# Altium schematic sheet UI.SchDoc
size A4
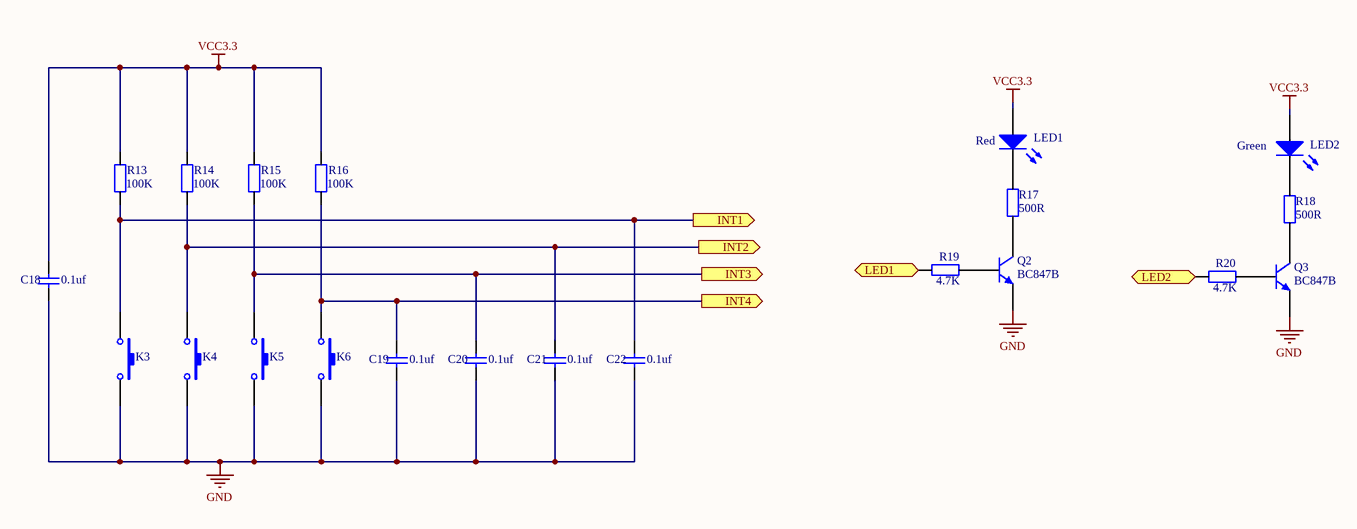
[diagram p0: UI.SchDoc]

## Parts
C18  value 0.1uf  [0603]  (hidden comment: Capacitor-0603)
C19  value 0.1uf  [0603]  (hidden comment: Capacitor-0603)
C20  value 0.1uf  [0603]  (hidden comment: Capacitor-0603)
C21  value 0.1uf  [0603]  (hidden comment: Capacitor-0603)
C22  value 0.1uf  [0603]  (hidden comment: Capacitor-0603)
K3  按键  [mini按键]  (value not drawn)
K4  按键  [mini按键]  (value not drawn)
K5  按键  [mini按键]  (value not drawn)
K6  按键  [mini按键]  (value not drawn)
LED1  Color: Red  [外插小灯]  (hidden comment: LED)
LED2  Color: Green  [外插小灯]  (hidden comment: LED)
Q2  BC847  [BC847B]  (value not drawn)
Q3  BC847  [BC847B]  (value not drawn)
R13  value 100K  [0603]  (hidden comment: Resistor-0603)
R14  value 100K  [0603]  (hidden comment: Resistor-0603)
R15  value 100K  [0603]  (hidden comment: Resistor-0603)
R16  value 100K  [0603]  (hidden comment: Resistor-0603)
R17  value 500R  [0603]  (hidden comment: Resistor-0603)
R18  value 500R  [0603]  (hidden comment: Resistor-0603)
R19  value 4.7K  [0603]  (hidden comment: Resistor-0603)
R20  value 4.7K  [0603]  (hidden comment: Resistor-0603)

## Ports
INT1 (out), INT2 (out), INT3 (out), INT4 (out), LED1 (in), LED2 (in)

## Nets
GND: C18.1 C19.1 C20.1 C21.1 C22.1 K3.2 K4.2 K5.2 K6.2 Q2.1(E) Q3.1(E)
VCC3.3: C18.2 LED1.1(A) LED2.1(A) R13.2 R14.2 R15.2 R16.2
INT1: C22.2 K3.1 R13.1 ; port INT1
INT2: C21.2 K4.1 R14.1 ; port INT2
INT3: C20.2 K5.1 R15.1 ; port INT3
INT4: C19.2 K6.1 R16.1 ; port INT4
LED1: R19.2 ; port LED1
LED2: R20.2 ; port LED2
NetLED1_2: LED1.2 R17.2
NetLED2_2: LED2.2 R18.2
NetQ2_2: Q2.2(B) R19.1
NetQ2_3: Q2.3(C) R17.1
NetQ3_2: Q3.2(B) R20.1
NetQ3_3: Q3.3(C) R18.1

## Library data of the parts
LED1 LED2 = LED: Value: LED
Q2 Q3 = BC847: Name: BC847B